# Altium schematic sheet keyboard.SchDoc
size A1
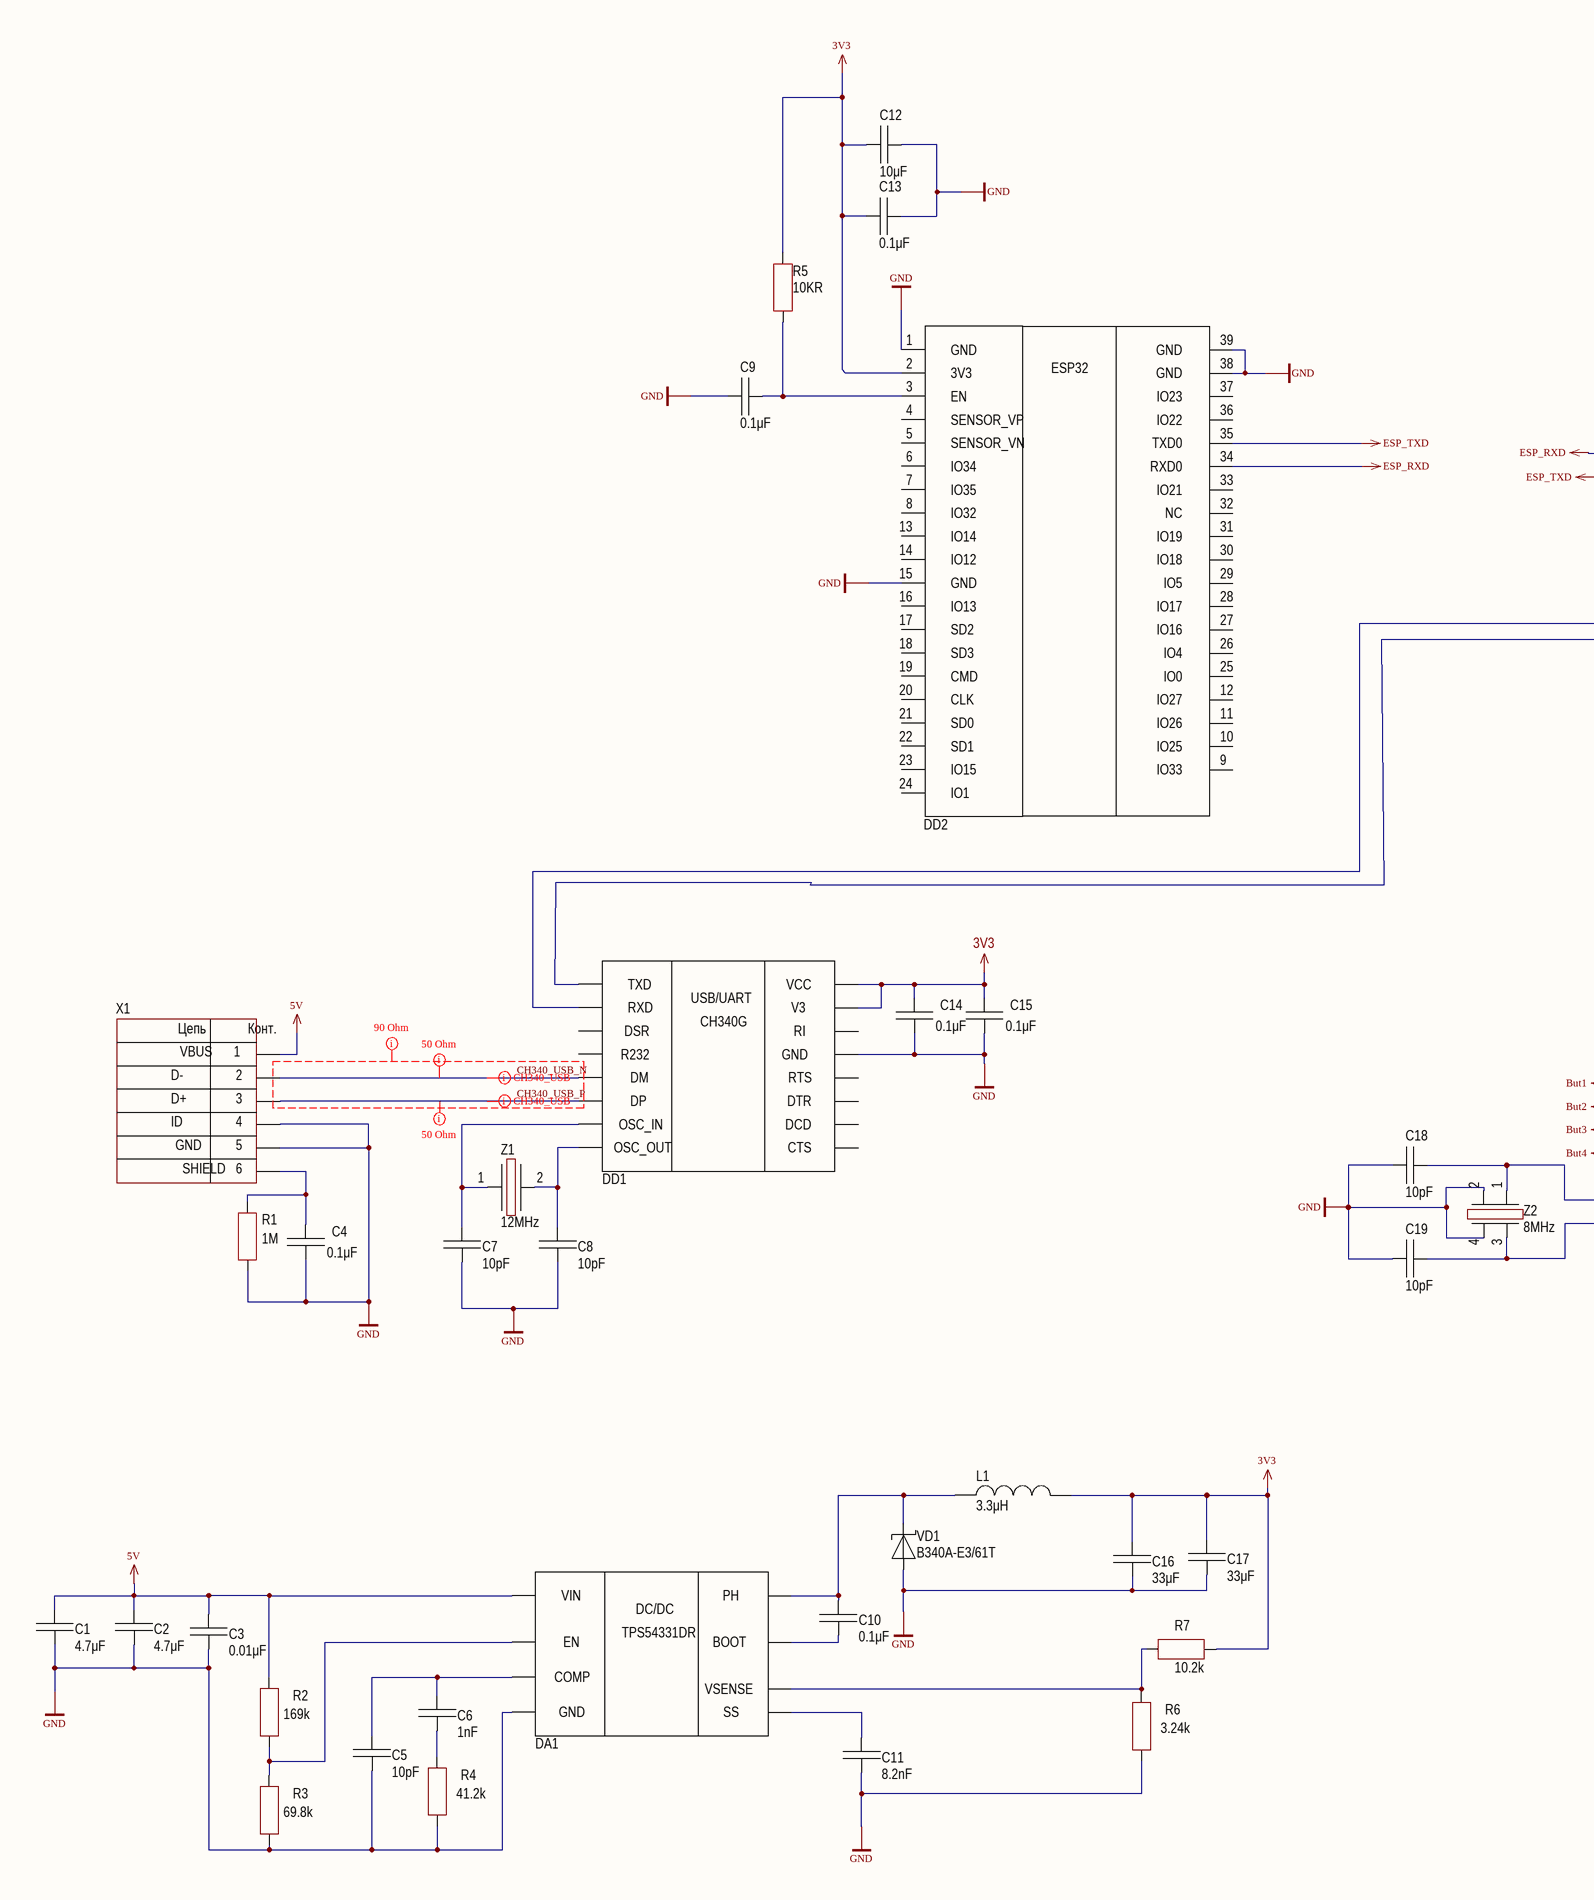
[diagram p0: keyboard.SchDoc, left]
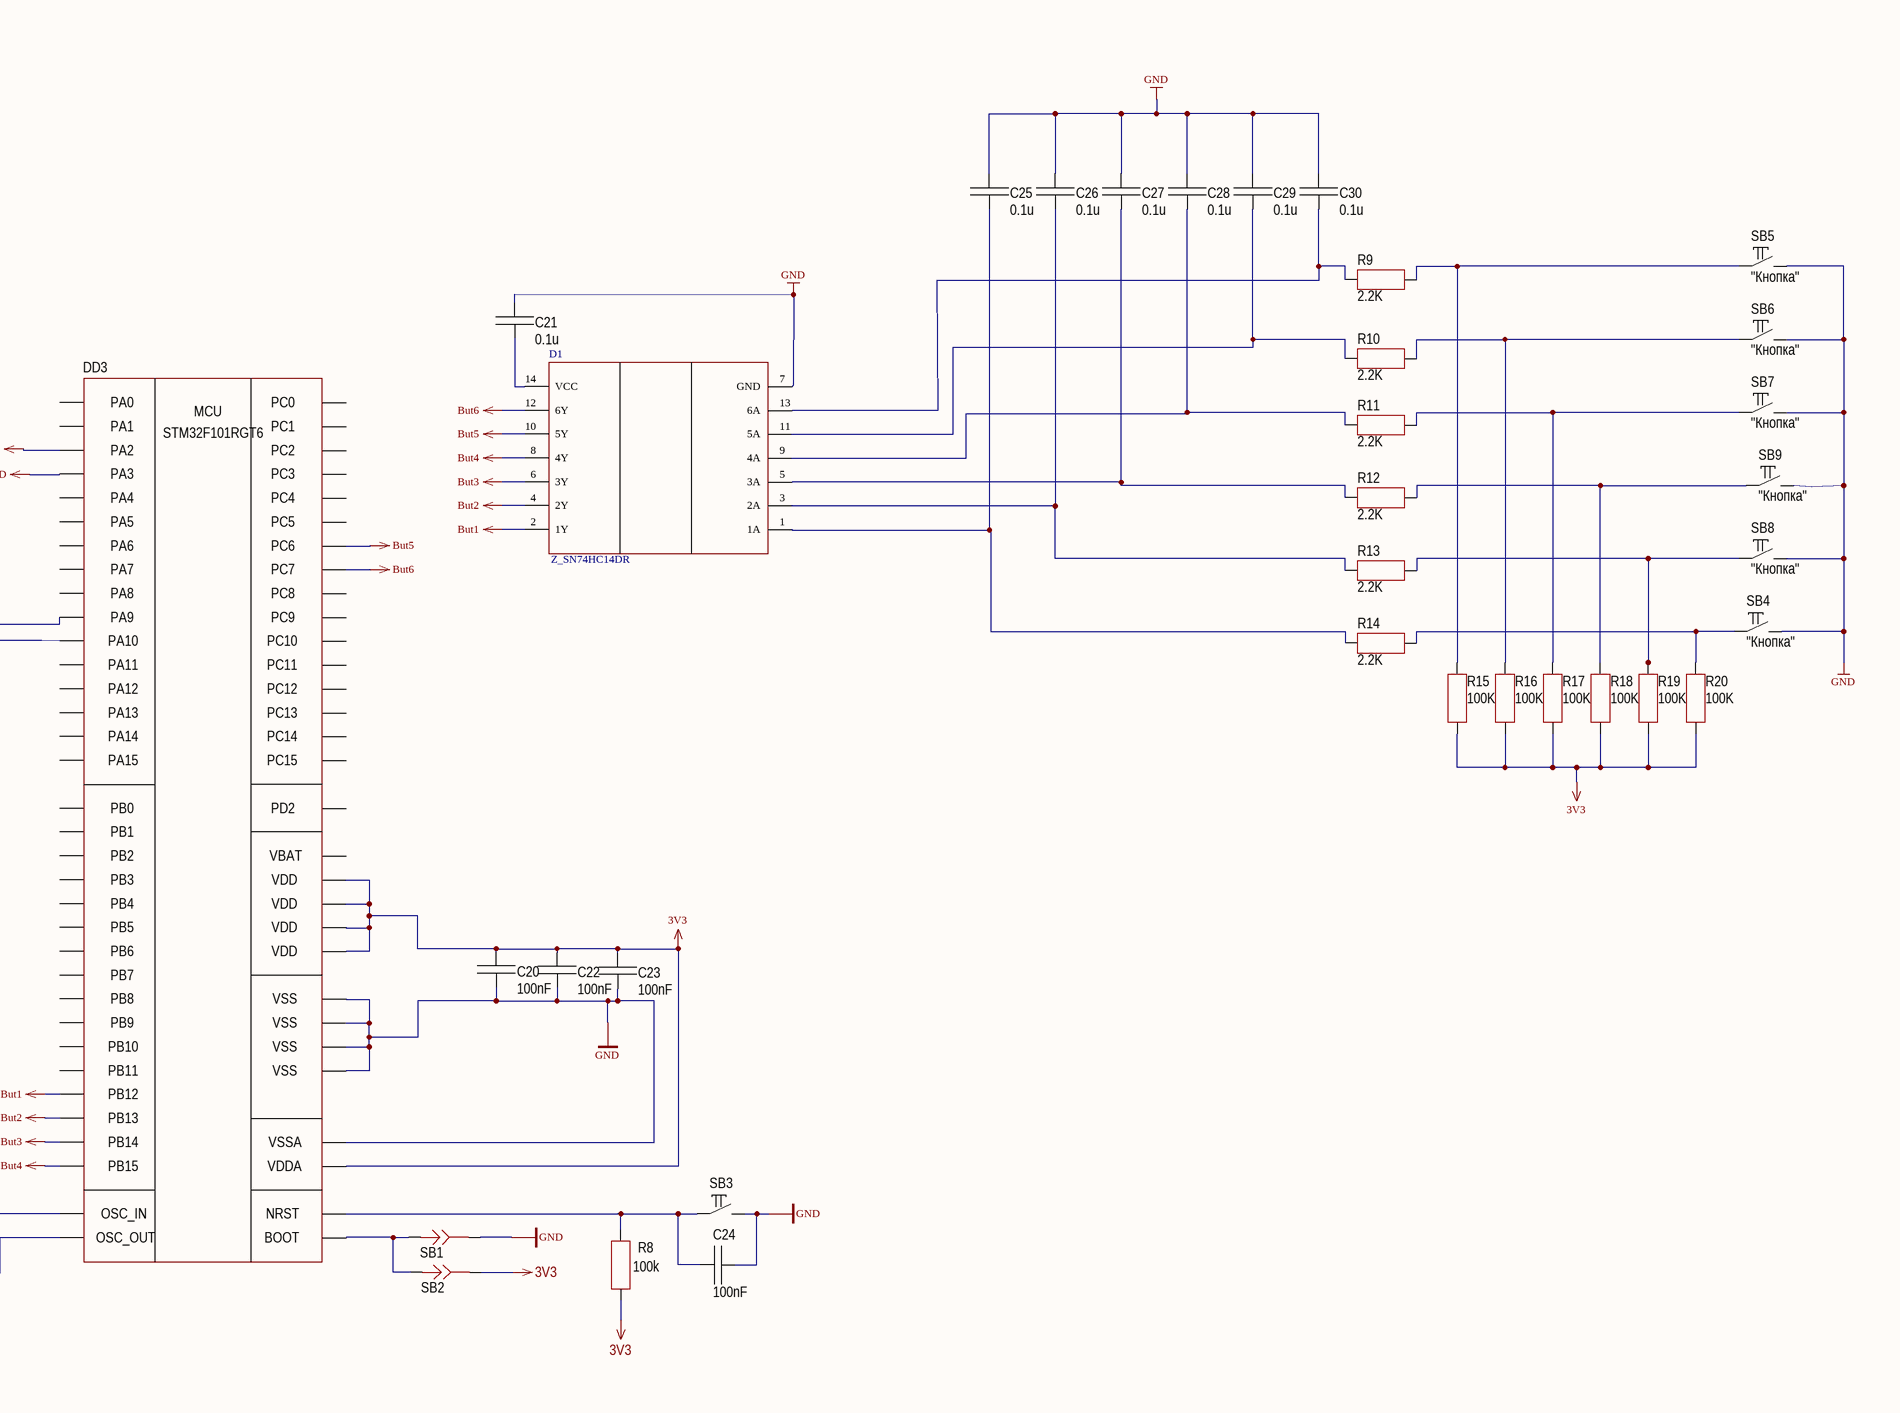
[diagram p1: keyboard.SchDoc, right]

## Parts
C1  value 4.7μF  [CAP: 0603]
C2  value 4.7μF  [CAP: 0603]
C3  value 0.01μF  [CAP: 0603]
C4  value 0.1μF  [CAP: 0603]
C5  value 10pF  [CAP: 0603]
C6  value 1nF  [CAP: 0603]
C7  value 10pF  [CAP: 0603]
C8  value 10pF  [CAP: 0603]
C9  value 0.1μF  [CAP: 0603]
C10  value 0.1μF  [CAP: 0603]
C11  value 8.2nF  [CAP: 0603]
C12  value 10μF  [CAP: 0603]
C13  value 0.1μF  [CAP: 0603]
C14  value 0.1μF  [CAP: 0603]
C15  value 0.1μF  [CAP: 0603]
C16  value 33μF  [CAP: 0805]
C17  value 33μF  [CAP: 0805]
C18  value 10pF  [CAP: 0603]
C19  value 10pF  [CAP: 0603]
C20  value 100nF  [CAP: 0603]
C21  value 0.1u  [CAP: 0805]
C22  value 100nF  [CAP: 0603]
C23  value 100nF  [CAP: 0603]
C24  value 100nF  [CAP: 0603]
C25  value 0.1u  [CAP: 0805]
C26  value 0.1u  [CAP: 0805]
C27  value 0.1u  [CAP: 0805]
C28  value 0.1u  [CAP: 0805]
C29  value 0.1u  [CAP: 0805]
C30  value 0.1u  [CAP: 0805]
D1  Z_SN74HC14DR  [14-SOIC]
DA1  (no value)  [8-SOIC]
DD1  (no value)  [16-SO]
DD2  Z_ESP32-WROOM-32  [ESP32-WROOM-32]  (value not drawn)
DD3  PartNumber: STM32F101RGT6  [64-LQFP]
L1  value 3.3μH  [IND: ETQP3MXXXKVN]
R1  value 1M  [RES: 0603]
R2  value 169k  [RES: 0603]
R3  value 69.8k  [RES: 0603]
R4  value 41.2k  [RES: 0603]
R5  value 10KR  [RES: 0603]
R6  value 3.24k  [RES: 0603]
R7  value 10.2k  [RES: 0603]
R8  value 100k  [RES: 0603]
R9  value 2.2K  [RES: 0603]
R10  value 2.2K  [RES: 0603]
R11  value 2.2K  [RES: 0603]
R12  value 2.2K  [RES: 0603]
R13  value 2.2K  [RES: 0603]
R14  value 2.2K  [RES: 0603]
R15  value 100K  [RES: 0603]
R16  value 100K  [RES: 0603]
R17  value 100K  [RES: 0603]
R18  value 100K  [RES: 0603]
R19  value 100K  [RES: 0603]
R20  value 100K  [RES: 0603]
SB1  (no value)  [RES: JMP]
SB2  (no value)  [RES: JMP]
SB3  (no value)  [BUT: 6x6 SMD]
SB4  CommentText: "Кнопка"  [BUT: 6x6 SMD]
SB5  CommentText: "Кнопка"  [BUT: 6x6 SMD]
SB6  CommentText: "Кнопка"  [BUT: 6x6 SMD]
SB7  CommentText: "Кнопка"  [BUT: 6x6 SMD]
SB8  CommentText: "Кнопка"  [BUT: 6x6 SMD]
SB9  CommentText: "Кнопка"  [BUT: 6x6 SMD]
VD1  PartNumber: B340A-E3/61T  [DIODE: SMA]
X1  (no value)  [CON: USB micro-A (ZX62-B-5PA)]
Z1  Frequency: 12MHz  [OSC: HC49/US]
Z2  Frequency: 8MHz  [OSC: 5032]

## Nets
3V3: C12.2 C13.2 C14.2 C15.2 C16.2 C17.2 C20.2 C22.2 C23.2 DD1.4(V3) DD1.16(VCC) DD2.2(3V3) DD3.13(VDDA) DD3.19(VDD) DD3.32(VDD) DD3.48(VDD) DD3.64(VDD) L1.1 R5.2 R7.1 R8.1 R15.1 R16.1 R17.1 R18.1 R19.1 R20.1 SB2.2
5V: C1.2 C2.2 C3.2 DA1.2(VIN) R2.2 X1.1
But1: D1.2(1Y) DD3.33(PB12)
But2: D1.4(2Y) DD3.34(PB13)
But3: D1.6(3Y) DD3.35(PB14)
But4: D1.8(4Y) DD3.36(PB15)
But5: D1.10(5Y) DD3.37(PC6)
But6: D1.12(6Y) DD3.38(PC7)
ESP_RXD: DD2.34(RXD0) DD3.16(PA2)
ESP_TXD: DD2.35(TXD0) DD3.17(PA3)
GND: C1.1 C2.1 C3.1 C4.1 C5.1 C7.1 C8.1 C9.2 C11.1 C12.1 C13.1 C14.1 C15.1 C16.1 C17.1 C18.1 C19.1 C20.1 C21.1 C22.1 C23.1 C24.1 C25.1 C26.1 C27.1 C28.1 C29.1 C30.1 D1.7(GND) DA1.7(GND) DD1.1(GND) DD2.1(GND) DD2.15(GND) DD2.38(GND) DD2.39(GND) DD3.12(VSSA) DD3.18(VSS) DD3.31(VSS) DD3.47(VSS) DD3.63(VSS) R1.1 R3.1 R4.1 R6.2 SB1.2 SB3.2 SB4.2 SB5.2 SB6.2 SB7.2 SB8.2 SB9.2 VD1.1 X1.4 X1.5 Z2.2 Z2.4
CH340_USB_N: DD1.6(DM) X1.2
CH340_USB_P: DD1.5(DP) X1.3
NetC4_2: C4.2 R1.2 X1.0
NetC5_2: C5.2 C6.2 DA1.6(COMP)
NetC6_1: C6.1 R4.2
NetC7_2: C7.2 DD1.7(OSC_IN) Z1.1
NetC8_2: C8.2 DD1.8(OSC_OUT) Z1.2
NetC9_1: C9.1 DD2.3(EN) R5.1
NetC10_1: C10.1 DA1.8(PH) L1.2 VD1.2
NetC10_2: C10.2 DA1.1(BOOT)
NetC11_2: C11.2 DA1.4(SS)
NetC18_2: C18.2 DD3.5(OSC_IN) Z2.1
NetC19_2: C19.2 DD3.6(OSC_OUT) Z2.3
NetC21_2: C21.2 D1.14(VCC)
NetC24_2: C24.2 DD3.7(NRST) R8.2 SB3.1
NetC25_2: C25.2 D1.1(1A) R14.1
NetC26_2: C26.2 D1.3(2A) R13.1
NetC27_2: C27.2 D1.5(3A) R12.1
NetC28_2: C28.2 D1.9(4A) R11.1
NetC29_2: C29.2 D1.11(5A) R10.1
NetC30_2: C30.2 D1.13(6A) R9.1
NetDA1_3: DA1.3(EN) R2.1 R3.2
NetDA1_5: DA1.5(VSENSE) R6.1 R7.2
NetDD1_2: DD1.2(TXD) DD3.43(PA10)
NetDD1_3: DD1.3(RXD) DD3.42(PA9)
NetDD3_60: DD3.60(BOOT) SB1.1 SB2.1
NetR9_2: R9.2 R15.2 SB5.1
NetR10_2: R10.2 R16.2 SB6.1
NetR11_2: R11.2 R17.2 SB7.1
NetR12_2: R12.2 R18.2 SB9.1
NetR13_2: R13.2 R19.2 SB8.1
NetR14_2: R14.2 R20.2 SB4.1

Not connected (* = marked no-connect by the designer): DD1 9(CTS) 10(DSR) 11(RI) 12(DCD) 13(DTR) 14(RTS) 15(R232); DD2 4(SENSOR_VP) 5(SENSOR_VN) 6(IO34) 7(IO35) 8(IO32) 9(IO33) 10(IO25) 11(IO26) 12(IO27) 13(IO14) 14(IO12) 16(IO13) 17(SD2) 18(SD3) 19(CMD) 20(CLK) 21(SD0) 22(SD1) 23(IO15) 24(IO1) 25(IO0) 26(IO4) 27(IO16) 28(IO17) 29(IO5) 30(IO18) 31(IO19) 32(NC) 33(IO21) 36(IO22) 37(IO23); DD3 1(VBAT) 2(PC13) 3(PC14) 4(PC15) 8(PC0) 9(PC1) 10(PC2) 11(PC3) 14(PA0) 15(PA1) 20(PA4) 21(PA5) 22(PA6) 23(PA7) 24(PC4) 25(PC5) 26(PB0) 27(PB1) 28(PB2) 29(PB10) 30(PB11) 39(PC8) 40(PC9) 41(PA8) 44(PA11) 45(PA12) 46(PA13) 49(PA14) 50(PA15) 51(PC10) 52(PC11) 53(PC12) 54(PD2) 55(PB3) 56(PB4) 57(PB5) 58(PB6) 59(PB7) 61(PB8) 62(PB9)

## Layout directives
mark named 50 Ohm: CH340_USB_N, CH340_USB_P
mark named 90 Ohm: CH340_USB_N, CH340_USB_P
differential pair: CH340_USB_N, CH340_USB_P

## Notes on the sheet
- (in symbol CON_USB_micro_TypeB) Цепь; Конт.; VBUS; D-; D+; ID; GND; SHIELD; 6
- (in symbol MCU_STM32F101RGT6) MCU
- (in symbol USB/UART_CH340G) USB/UART; CH340G
- (in symbol Z_ESP32-WROOM-32) ESP32

## Library data of the parts
C1 C2 = CAP_CERAMIC-SMD: ValueManufacturerPartNumber: Ceramic capacitor, 4.7μF, X7R, ±10%, 16V, 0603, -55...+125°C; TypeCapacitor: Ceramic capacitor; Tolerance: ±10%; TypeDielectric: X7R; Voltage: 16V; Package: 0603; Temperature: -55...+125°C
C3 = CAP_CERAMIC-SMD: ValueManufacturerPartNumber: Ceramic capacitor, 0.01μF, X7R, ±10%, 16V, 0603, -55...+125°C; TypeCapacitor: Ceramic capacitor; Tolerance: ±10%; TypeDielectric: X7R; Voltage: 16V; Package: 0603; Temperature: -55...+125°C
C4 C9 C10 C13-C15 = CAP_CERAMIC-SMD: ValueManufacturerPartNumber: Ceramic capacitor, 0.1μF, X7R, ±10%, 16V, 0603, -55...+125°C; TypeCapacitor: Ceramic capacitor; Tolerance: ±10%; TypeDielectric: X7R; Voltage: 16V; Package: 0603; Temperature: -55...+125°C
C5 C7 C8 C18 C19 = CAP_CERAMIC-SMD: ValueManufacturerPartNumber: Ceramic capacitor, 10pF, X7R, ±10%, 16V, 0603, -55...+125°C; TypeCapacitor: Ceramic capacitor; Tolerance: ±10%; TypeDielectric: X7R; Voltage: 16V; Package: 0603; Temperature: -55...+125°C
C6 = CAP_CERAMIC-SMD: ValueManufacturerPartNumber: Ceramic capacitor, 1nF, X7R, ±10%, 16V, 0603, -55...+125°C; TypeCapacitor: Ceramic capacitor; Tolerance: ±10%; TypeDielectric: X7R; Voltage: 16V; Package: 0603; Temperature: -55...+125°C
C11 = CAP_CERAMIC-SMD: ValueManufacturerPartNumber: Ceramic capacitor, 8.2nF, X7R, ±10%, 16V, 0603, -55...+125°C; TypeCapacitor: Ceramic capacitor; Tolerance: ±10%; TypeDielectric: X7R; Voltage: 16V; Package: 0603; Temperature: -55...+125°C
C12 = CAP_CERAMIC-SMD: ValueManufacturerPartNumber: Ceramic capacitor, 10μF, X7R, ±10%, 16V, 0603, -55...+125°C; TypeCapacitor: Ceramic capacitor; Tolerance: ±10%; TypeDielectric: X7R; Voltage: 16V; Package: 0603; Temperature: -55...+125°C
C16 C17 = CAP_CERAMIC-SMD: ValueManufacturerPartNumber: Ceramic capacitor, 33μF, X7R, ±10%, 16V, 0805, -55...+125°C; TypeCapacitor: Ceramic capacitor; Tolerance: ±10%; TypeDielectric: X7R; Voltage: 16V; Package: 0805; Temperature: -55...+125°C
C20 C22-C24 = CAP_CERAMIC-SMD: ValueManufacturerPartNumber: Ceramic capacitor, 100nF, X7R, ±10%, 16V, 0603, -55...+125°C; TypeCapacitor: Ceramic capacitor; Tolerance: ±10%; TypeDielectric: X7R; Voltage: 16V; Package: 0603; Temperature: -55...+125°C
C21 C25-C30 = Ceramic_0805: ValueManufacturerPartNumber: Ceramic capacitor, 0.1u, X7R, ±10%, 16V, 0805, -55...+125°C; TypeCapacitor: Ceramic capacitor; Tolerance: ±10%; TypeDielectric: X7R; Voltage: 16V; Package: 0805; Temperature: -55...+125°C
D1 = Z_SN74HC14DR: Schmitt trigger
DA1 = DC/DC_TPS54331DR: Step Down DC/DC; Manufacturer: TexasInstruments; SupplyIn: 3.5...28; MaxFrequency: 570kHz; MaxCurrent: 3A; HelpURL: https://www.ti.com/lit/ds/symlink/tps54331.pdf; Package: SOIC-8; ComponentType: DC/DC; ValueManufacturerPartNumber: =ComponentType+', '+CoreSize+', '+CoreProcessor+', '+Speed+', '+MemoryROM+', '+MemoryRAM+', '+Supply+', '+Temperature+', '+Package; Temperature: -40...+150°C; PartNumber: TPS54331DR
DD1 = USB/UART_CH340G: USB-to-UART; Manufacturer: DreamCity Innovations; ValueManufacturerPartNumber: IC usb-to-uart bridge, USB2.0, 3...3.6V, -40...+85°C, SOIC-16; Supply: 3...3.6V; HelpURL: http://wiki.amperka.ru/_media/articles:driver-ch340:ch340g-datasheet.pdf; Package: SOIC-16; ComponentType: IC usb-to-uart bridge; Temperature: -40...+85°C; Standard: USB2.0
DD3 = MCU_STM32F101RGT6: Cortex-M3; Manufacturer: STMicroelectronics; ValueManufacturerPartNumber: IC microcontroller, 32-Bit, Cortex-M3, 72MHz, 128KB, 20KB, 2...3.6V, -40...+85°C, 64-LQFP; Supply: 2...3.6V; Speed: 72MHz; CoreSize: 32-Bit; MemoryROM: 128KB; MemoryRAM: 20KB; HelpURL: https://www.digikey.com/product-detail/en/stmicroelectronics/STM32F103RBT6/497-6066-ND/1646341; Package: 64-LQFP; ComponentType: IC microcontroller; Temperature: -40...+85°C; CoreProcessor: Cortex-M3
L1 = IND_ETQP3M6R8KVN: Manufacturer: Murata Electronics; PartNumber: ETQP3M3R3KVN; ValueManufacturerPartNumber: Fixed inductor, 3.3μH, ±5%, SMD, 5A, -55...+155°C; TypeInductor: Fixed inductor; MaxCurrent: 5A; Tolerance: ±5%; Package: SMD; HelpURL: https://www.electronshik.ru/item/PAN/ETQP3M3R3KVN; Temperature: -55...+155°C
R1 = RES_SMD: Manufacturer: Yageo; PartNumber: RC0603JR-07100RL; ValueManufacturerPartNumber: Resistor film, 1M, ±5%, 0603, 0.1W, -55...+125°C; TypeResistor: Resistor film; Power: 0.1W; Tolerance: ±5%; Package: 0603; HelpURL: https://www.digikey.com/product-detail/en/yageo/RC0603JR-07100RL/311-100GRCT-ND/729644; Temperature: -55...+125°C
R2 = RES-SMD: Manufacturer: Yageo; PartNumber: RC0603JR-07100RL; ValueManufacturerPartNumber: Resistor film, 169k, ±5%, 0603, 0.1W, -55...+125°C; TypeResistor: Resistor film; Power: 0.1W; Tolerance: ±5%; Package: 0603; HelpURL: https://www.digikey.com/product-detail/en/yageo/RC0603JR-07100RL/311-100GRCT-ND/729644; Temperature: -55...+125°C
R3 = RES-SMD: Manufacturer: Yageo; PartNumber: RC0603JR-07100RL; ValueManufacturerPartNumber: Resistor film, 69.8k, ±5%, 0603, 0.1W, -55...+125°C; TypeResistor: Resistor film; Power: 0.1W; Tolerance: ±5%; Package: 0603; HelpURL: https://www.digikey.com/product-detail/en/yageo/RC0603JR-07100RL/311-100GRCT-ND/729644; Temperature: -55...+125°C
R4 = RES-SMD: Manufacturer: Yageo; PartNumber: RC0603JR-07100RL; ValueManufacturerPartNumber: Resistor film, 41.2k, ±5%, 0603, 0.1W, -55...+125°C; TypeResistor: Resistor film; Power: 0.1W; Tolerance: ±5%; Package: 0603; HelpURL: https://www.digikey.com/product-detail/en/yageo/RC0603JR-07100RL/311-100GRCT-ND/729644; Temperature: -55...+125°C
R5 = RES_SMD: Manufacturer: Yageo; PartNumber: RC0603JR-07100RL; ValueManufacturerPartNumber: Resistor film, 10KR, ±5%, 0603, 0.1W, -55...+125°C; TypeResistor: Resistor film; Power: 0.1W; Tolerance: ±5%; Package: 0603; HelpURL: https://www.digikey.com/product-detail/en/yageo/RC0603JR-07100RL/311-100GRCT-ND/729644; Temperature: -55...+125°C
R6 = RES-SMD: Manufacturer: Yageo; PartNumber: RC0603JR-07100RL; ValueManufacturerPartNumber: Resistor film, 3.24k, ±5%, 0603, 0.1W, -55...+125°C; TypeResistor: Resistor film; Power: 0.1W; Tolerance: ±5%; Package: 0603; HelpURL: https://www.digikey.com/product-detail/en/yageo/RC0603JR-07100RL/311-100GRCT-ND/729644; Temperature: -55...+125°C
R7 = RES-SMD: Manufacturer: Yageo; PartNumber: RC0603JR-07100RL; ValueManufacturerPartNumber: Resistor film, 10.2k, ±5%, 0603, 0.1W, -55...+125°C; TypeResistor: Resistor film; Power: 0.1W; Tolerance: ±5%; Package: 0603; HelpURL: https://www.digikey.com/product-detail/en/yageo/RC0603JR-07100RL/311-100GRCT-ND/729644; Temperature: -55...+125°C
R8 = RES_SMD: Manufacturer: Yageo; PartNumber: RC0603JR-07100RL; ValueManufacturerPartNumber: Resistor film, 100k, ±5%, 0603, 0.1W, -55...+125°C; TypeResistor: Resistor film; Power: 0.1W; Tolerance: ±5%; Package: 0603; HelpURL: https://www.digikey.com/product-detail/en/yageo/RC0603JR-07100RL/311-100GRCT-ND/729644; Temperature: -55...+125°C
R9-R14 = RES_SMD: Manufacturer: Yageo; PartNumber: RC0603JR-07100RL; ValueManufacturerPartNumber: Resistor film, 2.2K, ±5%, 0603, 0.1W, -55...+125°C; TypeResistor: Resistor film; Power: 0.1W; Tolerance: ±5%; Package: 0603; HelpURL: https://www.digikey.com/product-detail/en/yageo/RC0603JR-07100RL/311-100GRCT-ND/729644; Temperature: -55...+125°C
R15-R20 = RES_SMD: Manufacturer: Yageo; PartNumber: RC0603JR-07100RL; ValueManufacturerPartNumber: Resistor film, 100K, ±5%, 0603, 0.1W, -55...+125°C; TypeResistor: Resistor film; Power: 0.1W; Tolerance: ±5%; Package: 0603; HelpURL: https://www.digikey.com/product-detail/en/yageo/RC0603JR-07100RL/311-100GRCT-ND/729644; Temperature: -55...+125°C
SB1 SB2 = RES_JMP
SB3 = BUT_Tactile: Button; Manufacturer: TE Connectivity; PartNumber: 190533; ComponentKnd: Tactile button; CommentText: "Кнопка"; HelpURL: https://www.terraelectronica.ru/product/190533
SB4-SB9 = BUT_Tactile: Button; Manufacturer: TE Connectivity; PartNumber: 190533; ComponentKnd: Tactile button; HelpURL: https://www.terraelectronica.ru/product/190533
VD1 = DIODE_SCHOTTKY: ValueManufacturerPartNumber: Schottky diode, 40V, 3A, 1V, 15pF, SOD-123, -65...+150°C; TypeDiode: Schottky diode; Voltage: 40V; Current: 3A; VoltageDrop: 1V; RecoveryTime: 15pF; Package: SOD-123; HelpURL: https://www.digikey.com/product-detail/en/diodes-incorporated/MBR0580S1-7/MBR0580S1-7DICT-ND/5080371; Temperature: -65...+150°C
X1 = CON_USB_micro_TypeB: Micro USB type B; Manufacturer: Hirose Electric; PartNumber: 544814; CommentText: "USB"; ComponentKind: USB micro B; Model: USB type B; HelpURL: https://www.terraelectronica.ru/product/544814
Z1 = OSC_ABLS-12.000MHZ-B2-T: Manufacturer: Abracon; ValueManufacturerPartNumber: Crystal, 12MHz, 18pF, ±20ppm, HC49/US, -40...+85°C; TypeOscilator: Crystal; LoadCapacitance: 18pF; Tolerance: ±20ppm; PartNumber: ABLS-12.000MHZ-B2-T; Package: HC49/US; HelpURL: https://static.chipdip.ru/lib/142/DOC011142391.pdf; Temperature: -40...+85°C
Z2 = OSC_12.89007: Manufacturer: Geyer; ValueManufacturerPartNumber: Crystal, 8MHz, 16pF, ±30ppm, case 2016, -20...+70°C; TypeOscilator: Crystal; LoadCapacitance: 16pF; Tolerance: ±30ppm; PartNumber: 12.89007; Package: case 2016; HelpURL: https://www.geyer-electronic.com/uploads/tx_userartikelfrequenzstockfr/12.89007.pdf; Temperature: -20...+70°C